# EAGLE design 8-ultrasonic-to-nano (EAGLE 9.1.0)
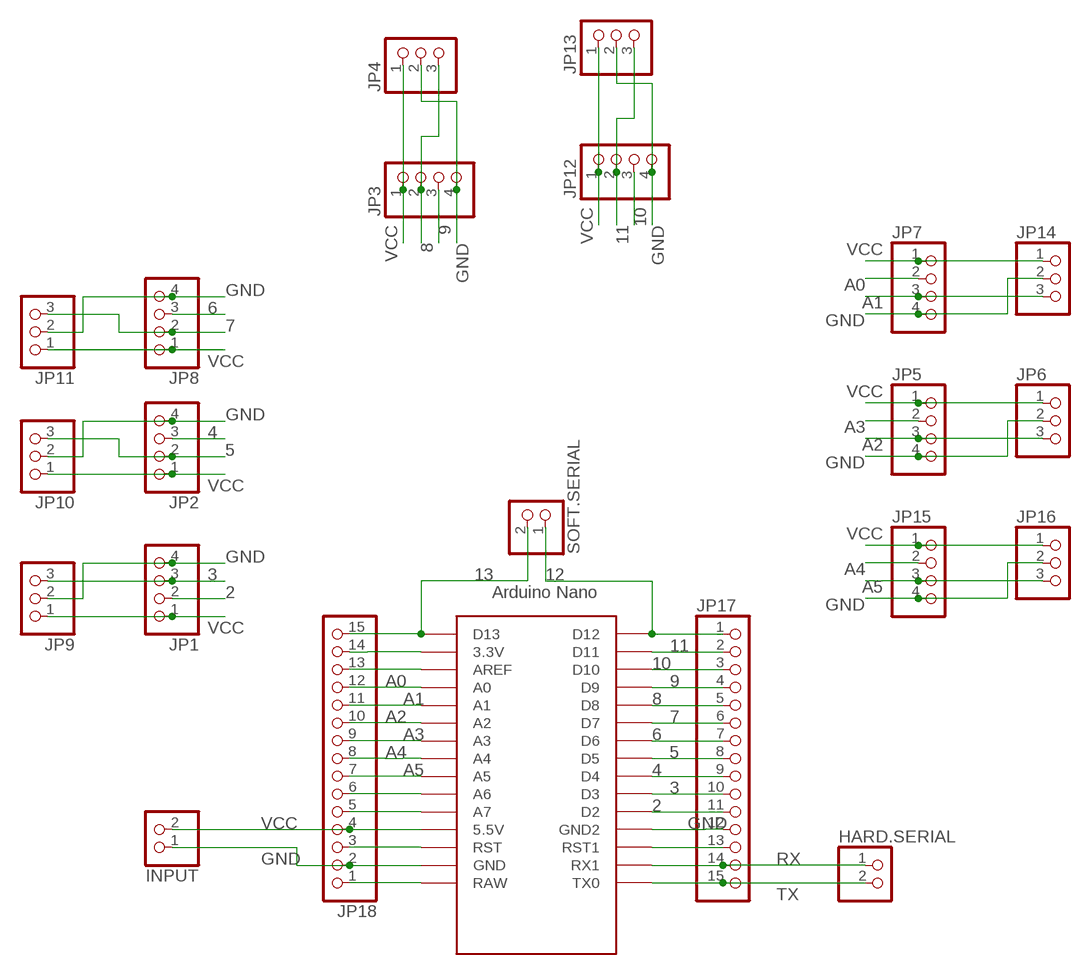
[diagram p0: schematic, sheet 1]

## Parts
HARD.SERIAL  PINHD-2_DATA  [1X02_DATA]
INPUT  PINHD-2_DATA  [1X02_DATA]
JP1  PINHD-4_DATA  [1X04_DATA]
JP2  PINHD-4_DATA  [1X04_DATA]
JP3  PINHD-4_DATA  [1X04_DATA]
JP4  PINHD-3_DATA  [1X03_DATA]
JP5  PINHD-4_DATA  [1X04_DATA]
JP6  PINHD-3_DATA  [1X03_DATA]
JP7  PINHD-4_DATA  [1X04_DATA]
JP8  PINHD-4_DATA  [1X04_DATA]
JP9  PINHD-3_DATA  [1X03_DATA]
JP10  PINHD-3_DATA  [1X03_DATA]
JP11  PINHD-3_DATA  [1X03_DATA]
JP12  PINHD-4_DATA  [1X04_DATA]
JP13  PINHD-3_DATA  [1X03_DATA]
JP14  PINHD-3_DATA  [1X03_DATA]
JP15  PINHD-4_DATA  [1X04_DATA]
JP16  PINHD-3_DATA  [1X03_DATA]
JP17  PINHD-1X15  [1X15]
JP18  PINHD-1X15  [1X15]
SOFT.SERIAL  PINHD-2_DATA  [1X02_DATA]
U$1  ARDUINO_NANO  [NANO]

## Nets
2: JP1.2 JP17.11 U$1.D2
3: JP1.3 JP9.3 JP17.10 U$1.D3
4: JP2.3 JP17.9 U$1.D4
5: JP2.2 JP10.3 JP17.8 U$1.D5
6: JP8.3 JP17.7 U$1.D6
7: JP8.2 JP11.3 JP17.6 U$1.D7
8: JP3.2 JP4.3 JP17.5 U$1.D8
9: JP3.3 JP17.4 U$1.D9
10: JP12.3 JP17.3 U$1.D10
11: JP12.2 JP13.3 JP17.2 U$1.D11
12: JP17.1 SOFT.SERIAL.1 U$1.D12
13: JP18.15 SOFT.SERIAL.2 U$1.D13
A0: JP7.2 JP18.12 U$1.A0
A1: JP7.3 JP14.3 JP18.11 U$1.A1
A2: JP5.3 JP6.3 JP18.10 U$1.A2
A3: JP5.2 JP18.9 U$1.A3
A4: JP15.2 JP18.8 U$1.A4
A5: JP15.3 JP16.3 JP18.7 U$1.A5
GND: INPUT.1 JP1.4 JP2.4 JP3.4 JP4.2 JP5.4 JP6.2 JP7.4 JP8.4 JP9.2 JP10.2 JP11.2 JP12.4 JP13.2 JP14.2 JP15.4 JP16.2 JP17.12 JP18.2 U$1.GND U$1.GND1(GND2)
N$3: JP17.13 U$1.RST1
N$4: JP18.14 U$1.3.3V
N$5: JP18.13 U$1.AREF
N$7: JP18.6 U$1.A6
N$8: JP18.5 U$1.A7
N$9: JP18.3 U$1.RST
N$10: JP18.1 U$1.RAW
RX: HARD.SERIAL.1 JP17.14 U$1.RX1
TX: HARD.SERIAL.2 JP17.15 U$1.TX0
VCC: INPUT.2 JP1.1 JP2.1 JP3.1 JP4.1 JP5.1 JP6.1 JP7.1 JP8.1 JP9.1 JP10.1 JP11.1 JP12.1 JP13.1 JP14.1 JP15.1 JP16.1 JP18.4 U$1.5V(5.5V)

## Library data of the parts
HARD.SERIAL INPUT SOFT.SERIAL = MIA_LIBRARY-2-2-2:PINHD-2_DATA: PIN HEADER
JP1-JP3 JP5 JP7 JP8 JP12 JP15 = MIA_LIBRARY-2-2-2:PINHD-4_DATA: PIN HEADER
JP4 JP6 JP9-JP11 JP13 JP14 JP16 = MIA_LIBRARY-2-2-2:PINHD-3_DATA: PIN HEADER
JP17 JP18 = MIA_LIBRARY-2-2-2:PINHD-1X15: PIN HEADER
U$1 = MIA_LIBRARY-2-2-2:ARDUINO_NANO: Arduino Nano

## Board
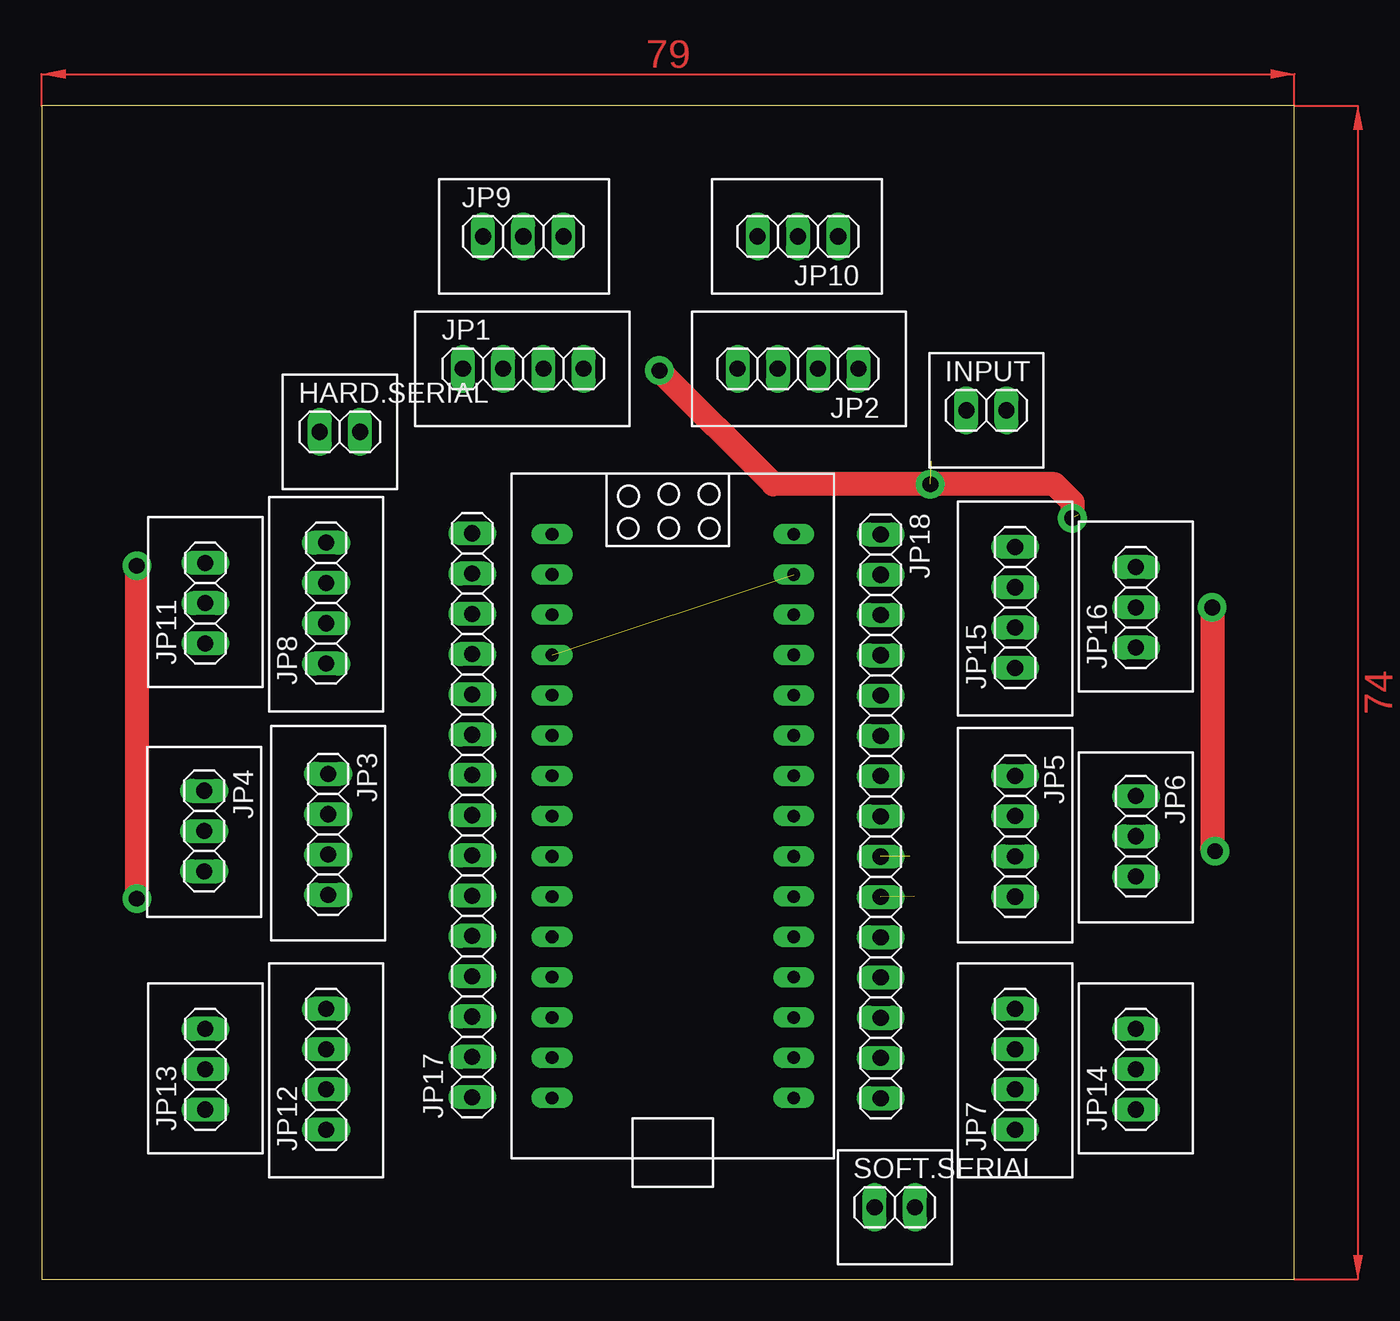
[diagram p1: board, top side]
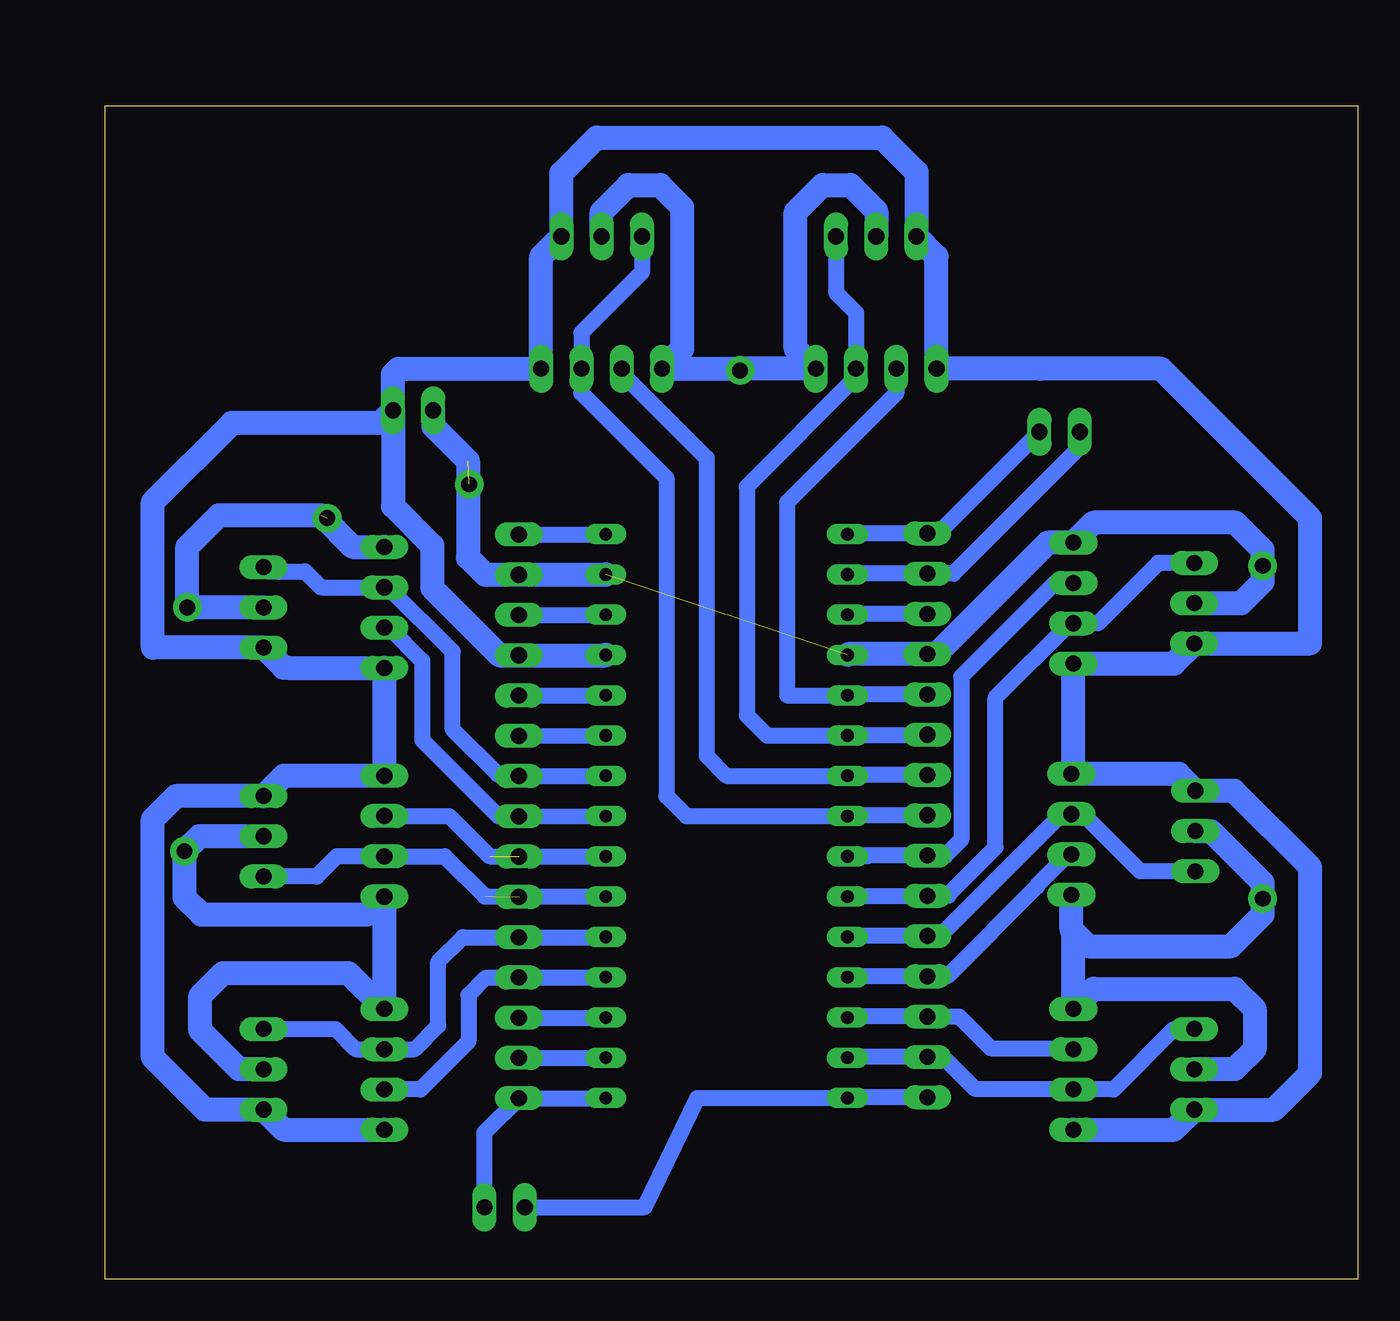
[diagram p2: board, bottom side, seen from below]

Size 79 x 74 mm. Coordinates in mm from the lower left corner, seen from the top.
Outline: 0,0 79,0 79,74 0,74 0,0
Copper layers (1*16): Top 0.035mm / dielectric 1.5mm / Bottom 0.035mm
Design rules "default": minimum track width 6mil, minimum drill 0.35mm, track to track 6mil, track to pad 6mil, pad to pad 6mil, via to via 6mil, smd to smd 6mil, copper to edge 40mil, drill to drill 6mil, minimum pad ring 10mil, minimum via ring 8mil, stop-mask expansion 4mil, vias tented up to drill 0mil, thermal gap 10mil

### Footprints (pad centres in the part's own frame; a part is rotated, then mirrored left to right if it is on the bottom)
1X02_DATA = drill 1.016 long: 1 -1.27,0; 2 1.27,0
1X04_DATA = drill 1.016 long: 1 -3.81,0; 2 -1.27,0; 3 1.27,0; 4 3.81,0
1X03_DATA = drill 1.016 long: 1 -2.54,0; 2 0,0; 3 2.54,0
1X15 = drill 1.016 long: 1 -17.78,0; 2 -15.24,0; 3 -12.7,0; 4 -10.16,0; 5 -7.62,0; 6 -5.08,0; 7 -2.54,0; 8 0,0; 9 2.54,0; 10 5.08,0; 11 7.62,0; 12 10.16,0; 13 12.7,0; 14 15.24,0; 15 17.78,0
NANO = drill 0.8 long: 3.3V -10.16,24.13; 5V -10.16,-1.27; A0 -10.16,19.05; A1 -10.16,16.51; A2 -10.16,13.97; A3 -10.16,11.43; A4 -10.16,8.89; A5 -10.16,6.35; A6 -10.16,3.81; A7 -10.16,1.27; AREF -10.16,21.59; D2 5.08,1.27; D3 5.08,3.81; D4 5.08,6.35; D5 5.08,8.89; D6 5.08,11.43; D7 5.08,13.97; D8 5.08,16.51; D9 5.08,19.05; D10 5.08,21.59; D11 5.08,24.13; D12 5.08,26.67; D13 -10.16,26.67; GND -10.16,-6.35; GND1 5.08,-1.27; RAW -10.16,-8.89; RST -10.16,-3.81; RST1 5.08,-3.81; RX1 5.08,-6.35; TX0 5.08,-8.89

### Placement (x,y rotation side)
HARD.SERIAL  18.8,53.44 0 top
INPUT  59.58,54.8 0 top
JP1  30.37,57.42 0 top
JP2  47.69,57.42 180 top
JP3  18.06,28.06 270 top
JP4  10.25,28.27 270 top
JP5  61.39,27.94 270 top
JP6  69.01,27.94 270 top
JP7  61.39,13.24 90 top
JP8  17.94,42.64 90 top
JP9  30.37,65.77 0 top
JP10  47.69,65.77 180 top
JP11  10.32,42.64 90 top
JP12  17.94,13.24 90 top
JP13  10.32,13.24 90 top
JP14  69.01,13.24 90 top
JP15  61.39,42.37 90 top
JP16  69.01,42.37 90 top
JP17  27.15,29.26 90 top
JP18  52.91,29.19 270 top
SOFT.SERIAL  53.8,4.54 0 top
U$1  37.26,38.1 180 top

### Tracks (layer width: path | path; a pad name or v marks a point on that pad's centre or on a via)
2
  Bottom 1: JP1.2 29.1,55.88 35.99,48.99 35.99,36.83 U$1.D2 32.13,36.88 JP17.11
3
  Bottom 1: JP9.3 32.91,62.23 31.64,60.96 JP1.3 31.64,56.88 38.53,49.99 38.53,35.56 37.26,34.29 U$1.D3 27.2,34.29 JP17.10
4
  Bottom 1: JP2.3 46.42,57.15 41.07,51.8 41.07,33.02 39.8,31.75 U$1.D4 32.13,31.8 JP17.9
5
  Bottom 1: JP10.3 45.15,63.5 48.96,59.69 JP2.2 48.96,55.88 43.61,50.53 43.61,30.48 42.34,29.21 U$1.D5 32.13,29.26 JP17.8
6
  Bottom 1: 30.91,26.67 U$1.D6 32.13,26.72 JP17.7 26,26.72 25,27.72 25,38 19.09,43.91 JP8.3
7
  Bottom 1: 25.82,24.18 JP17.6 | JP17.6 27.2,24.13 U$1.D7 | JP17.6 25.91,24.18 22.85,27.25 22.85,36.69 18.16,41.37 JP8.2 16.4,41.37 12.59,45.18 JP11.3
8
  Bottom 1: JP4.3 13.73,25.73 17.33,29.33 JP3.2 | U$1.D8 32.13,21.64 JP17.5 26.36,21.64 18.67,29.33 | 18.67,29.33 JP3.2 | 18.67,29.33 JP3.2
9
  Bottom 1: U$1.D9 32.13,19.1 JP17.4 25.9,19.1 20.24,24.76 20.24,24.84 18.28,26.79 JP3.3
10
  Bottom 1: U$1.D10 32.13,16.56 JP17.3 25.15,16.56 23.15,14.56 17.99,14.56 JP12.3
11
  Bottom 1: JP13.3 11.59,15.78 15.4,11.97 JP12.2 17.99,12.02 24.15,12.02 26.15,14.02 JP17.2 32.13,14.02 U$1.D11
12
  Bottom 1: JP17.1 32.13,11.48 U$1.D12 41.65,11.43 44.98,4.54 SOFT.SERIAL.1
13
  Bottom 1: U$1.D13 47.44,11.41 JP18.15 55.07,9.25 SOFT.SERIAL.2
A0
  Bottom 1: U$1.A0 47.44,19.03 JP18.12 52.94,19 55,19 56.09,17.91 56.09,15 59.12,11.97 JP7.2
A1
  Bottom 1: JP14.3 64.47,15.78 63.2,14.51 JP7.3 59.49,14.51 58,16 58,20 56.43,21.57 JP18.11 47.44,21.57 U$1.A1
A2  (1 unrouted)
  Bottom 1: U$1.A2 55.04,24.13 57.58,26.67 JP5.3 64.39,26.67 65.66,25.4 JP6.3
A3  (1 unrouted)
  Bottom 1: U$1.A3 54.77,26.67 57.31,29.21 JP5.2
A4
  Bottom 1: JP18.8 U$1.A4 | JP18.8 53.91,29.19 | JP18.8 54.19,29.19 59,34 59,39 61.1,41.1 JP15.2
A5
  Bottom 1: JP16.3 68.74,44.64 66.39,44.64 65.39,43.64 JP15.3 61.14,43.64 57.09,39.59 57.09,34.69 54.26,31.86 53.03,31.86 JP18.7 U$1.A5
GND  (via drill 1 pad 1.8)  (3 unrouted)
  Top 1.5: v6,45 v6,24 | v74,27 73.81,27.19 73.81,42.4 73.82,42.39 v73.82,42.37 | v38.96,57.31 46.13,50.13 v56.04,50.13 63.87,50.13 65,49 v65,48
  Bottom 1.5: JP13.2 7.78,13.24 6.51,14.51 6.51,17.05 7.78,18.32 16.67,18.32 JP12.4 17.94,21.94 18,22 18.06,22.06 | JP16.2 v73.82,42.37 73.82,46.18 71.82,48.18 65.39,48.18 | JP14.2 70.55,13.24 73,15.69 73,17.87 71.55,19.32 63.66,19.32 JP7.4 JP5.4 62.52,23 72.91,23 74,24.09 v74,27 73.06,27.94 JP6.2 | 18.06,22.06 JP3.4 | JP10.2 47.69,67.31 46,69 44,69 42.61,67.61 42.61,58.69 JP2.4 38.85,57.42 | JP9.2 30.37,67.37 32,69 33.76,69 35.45,67.31 35.45,58.69 JP1.4 38.85,57.42 | 58.31,54.26 INPUT.1 58.31,53.8 56.36,51.85 56.11,51.6 56.11,45.52 55.03,44.43 JP18.2 47.44,44.43 U$1.GND | U$1.GND1 32.13,39.42 JP17.12 26.58,39.42 19.55,46.45 JP8.4 16.67,47.72 7.72,47.72 6,46 v6,45 6,44 7.36,42.64 JP11.2 | 65.39,48.18 63.39,46.18 JP15.4 | JP4.2 9.27,28.27 6,25 v6,24 6,23 8,21 17,21 18.06,22.06 | 65.39,48.18 | 38.85,57.42 v38.96,57.31
N$3
  Bottom 1: JP17.13 32.13,41.96 U$1.RST1
N$4
  Bottom 1: JP18.14 47.44,13.95 U$1.3.3V
N$5
  Bottom 1: JP18.13 47.44,16.49 U$1.AREF
N$7
  Bottom 1: JP18.6 U$1.A6
N$8
  Bottom 1: JP18.5 U$1.A7
N$9
  Bottom 1: JP18.3 47.44,41.89 U$1.RST
N$10
  Bottom 1: JP18.1 47.44,46.97 U$1.RAW
RX
  Bottom 1: JP17.14 32.13,44.5 U$1.RX1 | JP17.14 26.78,44.5 | HARD.SERIAL.1 17.53,52.47 25.5,44.5 JP17.14
TX
  Bottom 1: U$1.TX0 32.13,47.04 JP17.15 26.47,47.04 HARD.SERIAL.2
VCC
  Bottom 1.5: JP12.1 11.59,9.43 JP13.1 5.3,10.7 3,13 3,26 7.81,30.81 JP4.1 11.31,31.87 JP3.1 17.94,31.99 JP8.1 11.59,38.83 JP11.1 3,40.1 3,48 12.42,57.42 20,57.42 JP1.1 26.56,64.5 JP9.1 27.83,69.83 30,72 48,72 50.23,69.77 JP10.1 51.5,64.5 JP2.1 60.5,57.42 60.85,57.07 INPUT.2 | JP7.1 67.74,9.43 JP14.1 72.7,10.7 76,14 76,29 74.52,30.48 JP6.1 | 69.04,30.45 JP6.1 | JP6.1 67.74,31.75 JP5.1 JP15.1 67.46,38.56 67.47,38.58 67.76,38.58 JP16.1 76,39.83 76,49 71,54 61.65,54 INPUT.2 | U$1.5V 47.44,39.35 JP18.4 54.11,39.35 58.37,43.6 58.37,46.27 60.85,48.76 INPUT.2
(copper drawn outside any net)
  shapes: Top area x2